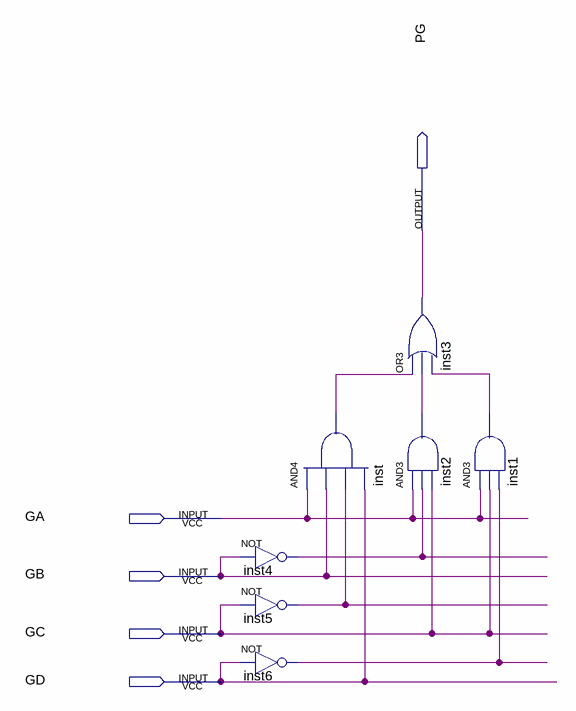
[diagram p0: schematic sheet]
// Quartus schematic ColunaG.bdf as structural Verilog: 7 symbols, 5 pins
module ColunaG (
  input  GA,
  input  GB,
  input  GC,
  input  GD,
  output PG
);

  wire inst1_out, inst2_out, inst4_out, inst5_out, inst6_out, inst_out;

  not inst4 (inst4_out, GB);
  not inst5 (inst5_out, GC);
  not inst6 (inst6_out, GD);
  and inst (inst_out, GA, GB, inst5_out, GD);
  or inst3 (PG, inst_out, inst2_out, inst1_out);
  and inst2 (inst2_out, GA, inst4_out, GC);
  and inst1 (inst1_out, GA, GC, inst6_out);
endmodule
